# EasyEDA Pro project ProPrj_EDA-RobotPro AI智能机器狗_2025-11-01.epro

# Schematic EDA-RobotPro
Board Name: V0.1; Create Date: 2025-10-06; Page Name: P1; Project Name: EDA-RobotPro_机器狗Pro; Schematic Name: EDA-RobotPro; Update Date: 2025-11-01; Company: 嘉立创EDA; Page Size: A4; Version: V1.0
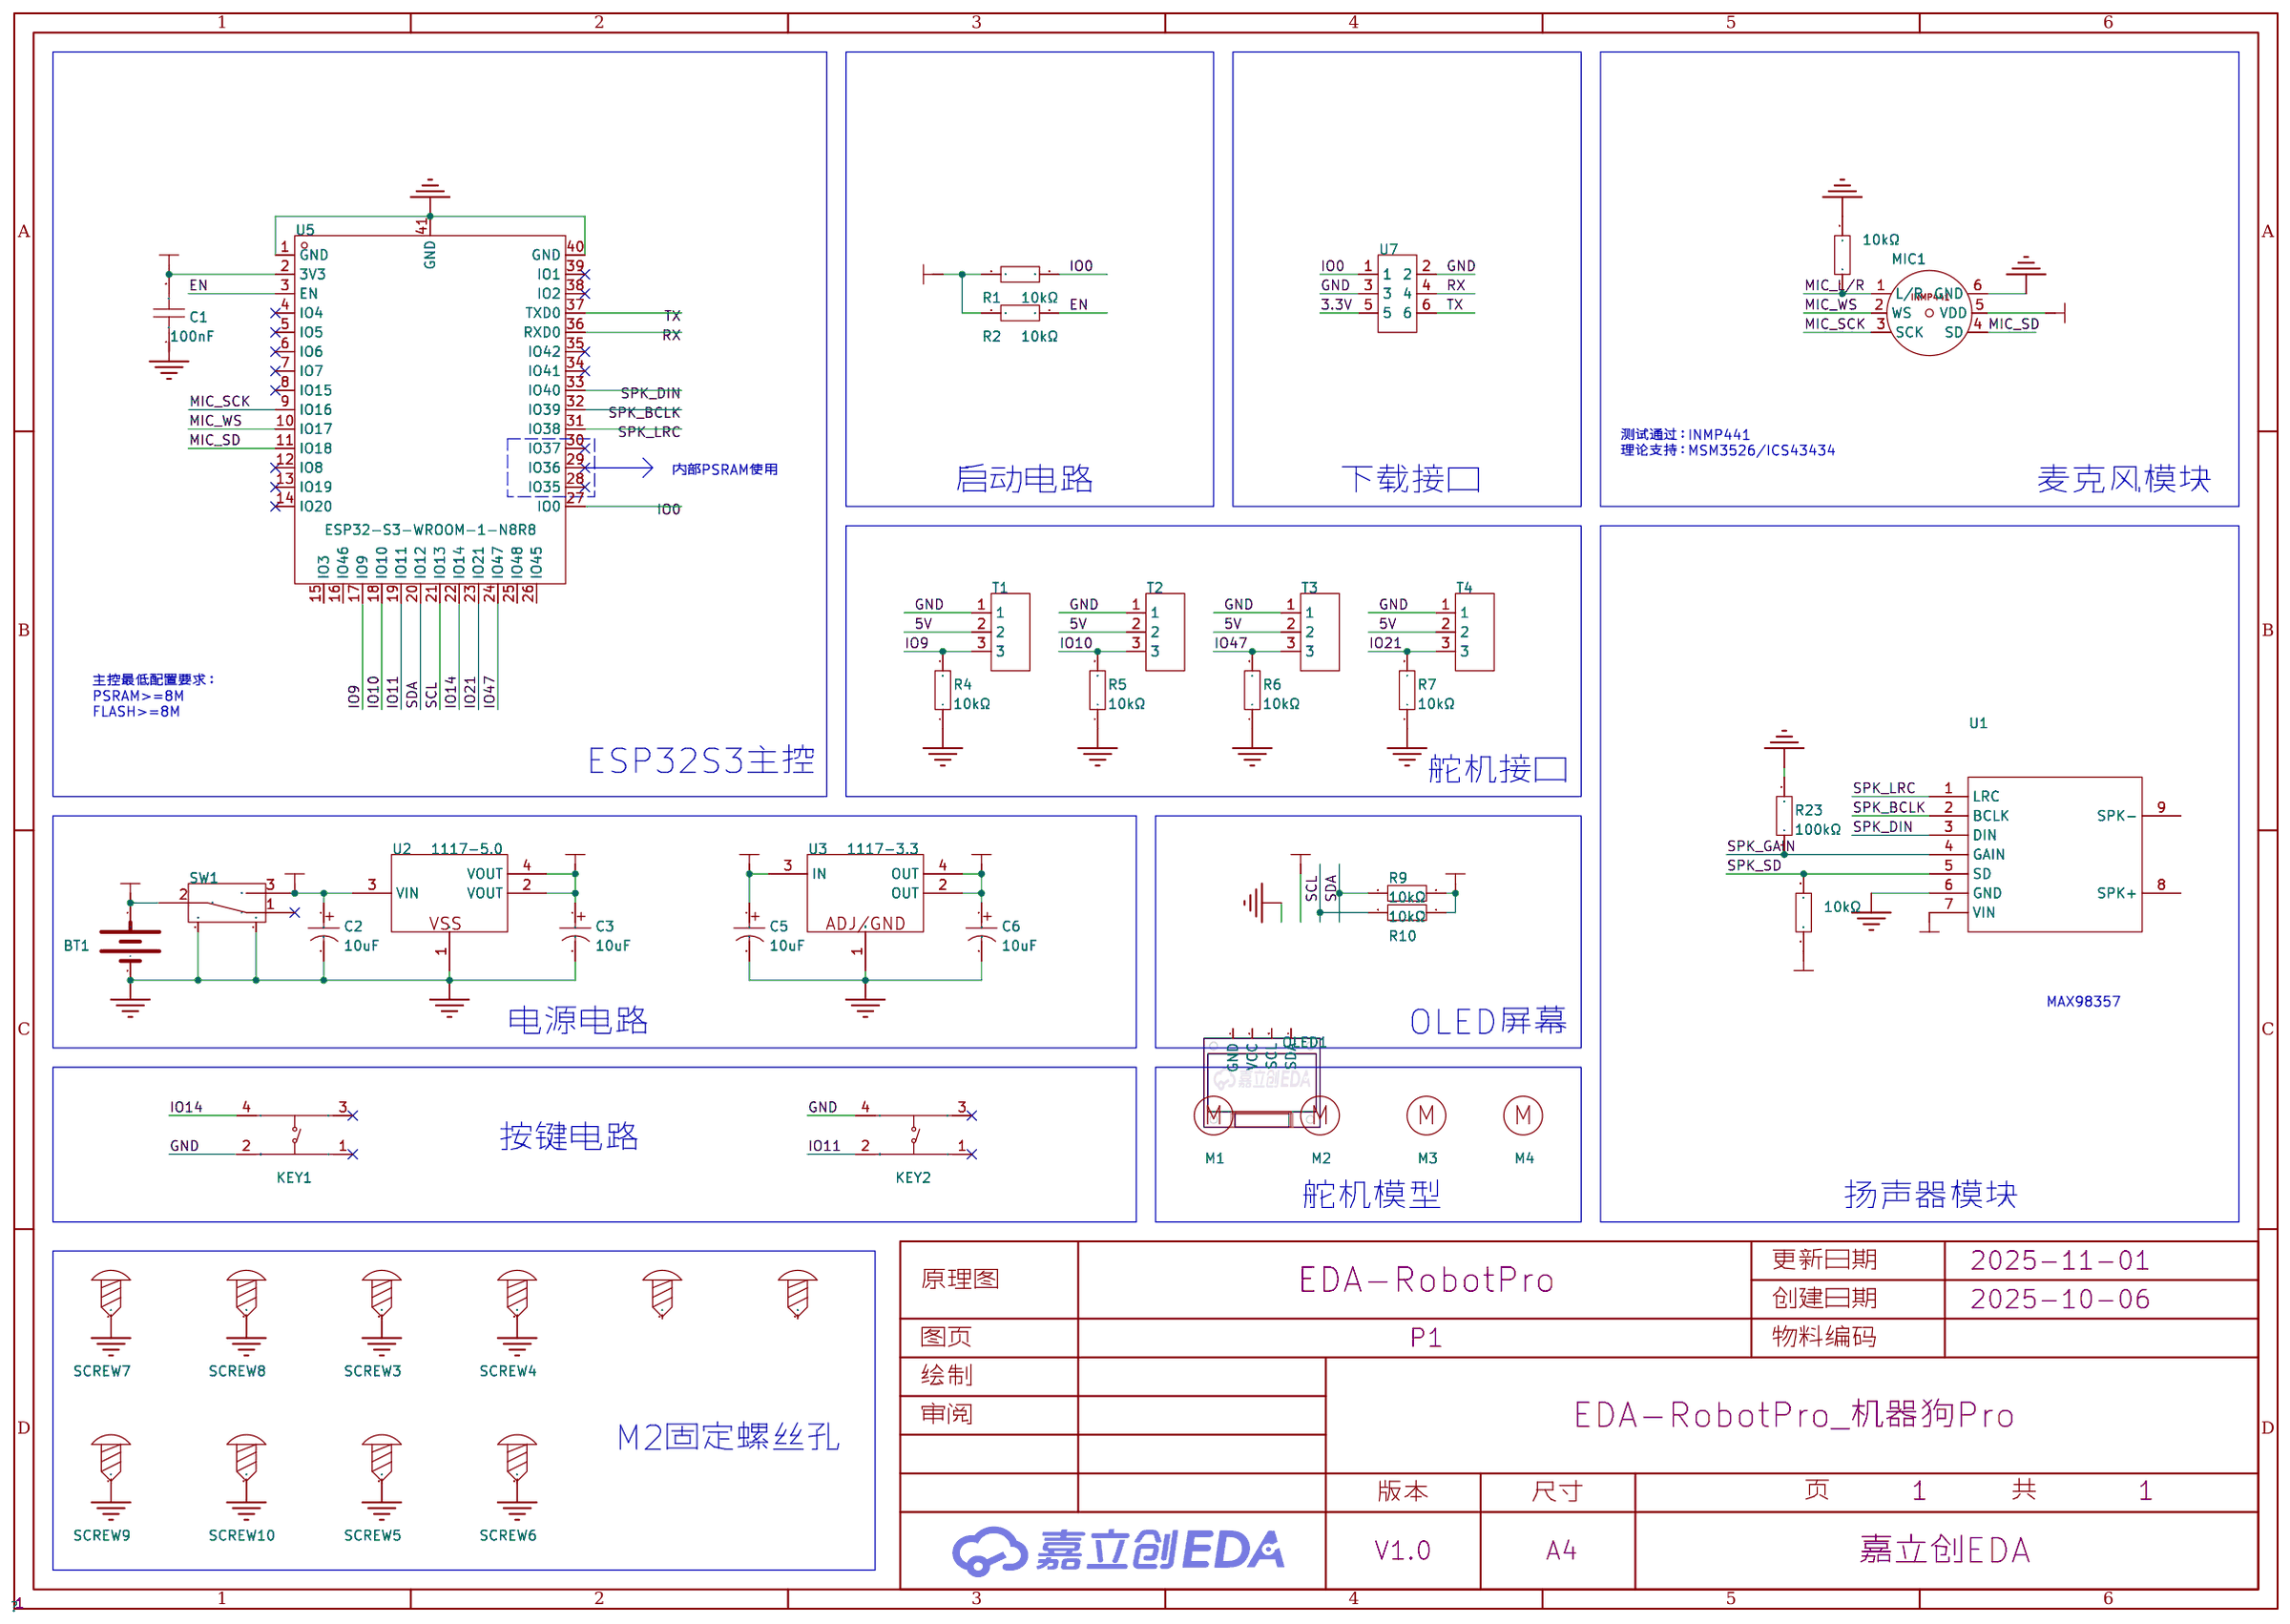
[diagram p0: schematic sheet]

## Parts
BT1  -  [2节串联14500电池盒]
C1  100nF  [CAP-TH_L4.2-W3.5-P2.54-D0.5]
C2  10uF  [CAP-TH_BD4.0-P1.50-D0.8-FD]
C3  10uF  [CAP-TH_BD4.0-P1.50-D0.8-FD]
C5  10uF  [CAP-TH_BD4.0-P1.50-D0.8-FD]
C6  10uF  [CAP-TH_BD4.0-P1.50-D0.8-FD]
KEY1  TS665CJ  [SW-TH_4P-L6.0-W6.0-P4.50-LS6.5]
KEY2  TS665CJ  [SW-TH_4P-L6.0-W6.0-P4.50-LS6.5]
M1  -  [舵机]  (no BOM)
M2  -  [舵机]  (no BOM)
M3  -  [舵机]  (no BOM)
M4  -  [舵机]  (no BOM)
MIC1  -  [COMM-TH_INMP441]
OLED1  -  [0.96OLED_4P]
R1  10kΩ  [RES-TH_BD2.4-L6.3-P10.30-D0.6]
R2  10kΩ  [RES-TH_BD2.4-L6.3-P10.30-D0.6]
R4  10kΩ  [RES-TH_BD2.4-L6.3-P10.30-D0.6]
R5  10kΩ  [RES-TH_BD2.4-L6.3-P10.30-D0.6]
R6  10kΩ  [RES-TH_BD2.4-L6.3-P10.30-D0.6]
R7  10kΩ  [RES-TH_BD2.4-L6.3-P10.30-D0.6]
R9  10kΩ  [RES-TH_BD2.4-L6.3-P10.30-D0.6]
R10  10kΩ  [RES-TH_BD2.4-L6.3-P10.30-D0.6]
R20  10kΩ  [RES-TH_BD2.4-L6.3-P10.30-D0.6]
R22  10kΩ  [RES-TH_BD2.4-L6.3-P10.30-D0.6]
R23  100kΩ  [RES-TH_BD2.4-L6.3-P10.30-D0.6]
SCREW1  -  [M2螺丝]
SCREW2  -  [M2]
SCREW3  -  [M2]
SCREW4  -  [M2]
SCREW5  -  [M2]
SCREW6  -  [M2]
SCREW7  -  [M2]
SCREW8  -  [M2]
SCREW9  -  [M2]
SCREW10  -  [M2]
SW1  -  [拨动开关_侧]
T1  PZ254V-11-03P  [HDR-TH_3P-P2.54-V-M]
T2  PZ254V-11-03P  [HDR-TH_3P-P2.54-V-M]
T3  PZ254V-11-03P  [HDR-TH_3P-P2.54-V-M]
T4  PZ254V-11-03P  [HDR-TH_3P-P2.54-V-M]
U1  -  [MAX98357]
U2  1117-5.0  [SOT-223-4_L6.5-W3.5-P2.30-LS7.0-BR]
U3  1117-3.3  [SOT-223-3_L6.4-W3.5-P2.30-LS7.0-BR]
U5  ESP32-S3-WROOM-1-N8R8  [WIRELM-SMD_ESP32-S3-WROOM-1]
U7  ZX-PZ2.54-2-3PZZ  [HDR-TH_6P-P2.54-V-M-R2-C3-S2.54-1]

## Library data of the parts
BT1 = 2节串联14500电池组: 连接器类型:电池底座;适用电池规格:CR1220;触头材质:磷青铜;工作温度范围:-25℃~+85℃;; JLCPCB Part Class: 扩展库
C1 = 178MU0006: 容值:100nF;精度:±10%;额定电压:50V;温度系数:X7R;; LCSC Part Name: 100nF ±10% 50V; Supplier Part: C5632430; Manufacturer: KNSCHA(科尼盛); Supplier Footprint: 插件,P=2.54mm; JLCPCB Part Class: 扩展库; Datasheet: https://atta.szlcsc.com/upload/public/pdf/source/20230506/6B3136079A6D587E863927628E877AC6.pdf; Supplier: LCSC; Tolerance: ±10%; Voltage Rated: 50V; Temperature Coefficient: X7R
C2 C3 C5 C6 = KS106M025C07RR0VH2FP0: 容值:10uF;精度:±20%;额定电压:25V;纹波电流:29mA@120Hz;等效串联电阻:-;; LCSC Part Name: 10uF ±20% 25V; Supplier Part: C43351; Manufacturer: CX(承兴); Supplier Footprint: 插件,D4xL7mm; JLCPCB Part Class: 扩展库; Datasheet: https://atta.szlcsc.com/upload/public/pdf/source/20211027/7B10195EF01EB9374BE8935690E3D906.pdf; Supplier: LCSC; Tolerance: ±20%; Rated Voltage: 25V; Ripple Current: 29mA@120Hz; Lead Spacing: 1.5mm; φD: 4mm; L: 7mm; Lifetime @ Temp: 1000hrs@105℃; Operating Temperature: -40℃~+105℃
KEY1 KEY2 = TS665CJ: 电路结构:单刀单掷;按钮形状:圆形按钮;安装方式:直插;开关长度:6mm;开关宽度:6mm;开关高度:5mm;触点电流:50mA;额定电压(DC):12V;带灯:-;机械寿命:-;; LCSC Part Name: 6*6*5mm 直插 轻触开关; Supplier Part: C393938; Manufacturer: SHOU HAN(首韩); Supplier Footprint: 插件; JLCPCB Part Class: 扩展库; Datasheet: https://atta.szlcsc.com/upload/public/pdf/source/20190521/C393938_BDABEAC600B4C55E200A80AA129B70BC.pdf; Supplier: LCSC; Circuit: 单刀单掷; Actuator Style: 圆形按钮; Mounting Style: 直插; Switch Length: 6mm; Switch Width: 6mm; Switch Height: 5mm; Contact Current: 50mA; Voltage Rating (DC): 12V
M1-M4 = SG90舵机(180度版): JLCPCB Part Class: 扩展库
MIC1 = inmp441: inmp441麦克风
OLED1 = 0.96OLED模块_4P: Supplier Footprint: 插件
R1 R2 R4-R7 R9 R10 R20 R22 = RN1/4W10KFT/BA1: 电阻类型:金属膜电阻;阻值:10kΩ;精度:±1%;功率:250mW;温度系数:±50ppm/℃;; LCSC Part Name: 10kΩ ±1% 250mW 金属膜电阻; Supplier Part: C410695; Manufacturer: Tyohm(幸亚电阻); Supplier Footprint: 插件,D2.4xL6.5mm; JLCPCB Part Class: Extended Part; Datasheet: https://atta.szlcsc.com/upload/public/pdf/source/20190808/C410699_D126E64D28B638F1D73B58E9F61DFD9B.pdf; Supplier: LCSC; Type: 金属膜电阻; Tolerance: ±1%; Overload Voltage (Max): 250V; Power(Watts): 250mW; Temperature Coefficient: ±50ppm/℃; Operating Temperature Range: -55℃~+125℃
R23 = MFR-25JT-52-100K: 电阻类型:金属膜电阻;阻值:100kΩ;精度:±5%;功率:250mW;; LCSC Part Name: 金属膜电阻 100kΩ ±5% 250mW; Supplier Part: C176449; Manufacturer: YAGEO(国巨); Supplier Footprint: 插件,D2.4xL6.3mm; JLCPCB Part Class: Extended Part; Datasheet: https://atta.szlcsc.com/upload/public/pdf/source/20191118/C457825_18355E864DE4965678DC27B0EBC3E21E.pdf; Supplier: LCSC; Type: 金属膜电阻; Tolerance: ±5%; Power(Watts): 250mW; Operating Temperature: -55℃~+155℃
SCREW1-SCREW10 = M2螺丝: Supplier Footprint: 插件
SW1 = 拨动开关_侧: Supplier Footprint: 插件
T1-T4 = PZ254V-11-03P: 插针结构:1x3P;间距:2.54mm;行距:-;圆针/方针:方针;安装类型:直插;排数:单排;总PIN位数:3P;额定电流:3A;额定电压:250V;配合针长度:6mm;塑高:2.5mm;端接针长度:3mm;工作温度范围:-40℃~+105℃;颜色:黑色;; LCSC Part Name: 间距:2.54mm 1x3P 直插 方针; Supplier Part: C2937625; Manufacturer: XFCN(兴飞); Supplier Footprint: 插件,P=2.54mm; JLCPCB Part Class: 扩展库; Datasheet: https://atta.szlcsc.com/upload/public/pdf/source/20200309/C492402_8335C3D49C4E4C618838D59BB1D024C1.pdf; Supplier: LCSC; Pin Structure: 1x3P; Pitch: 2.54mm; Circluar Pins/Square Pins: 方针; Mounting Type: 直插; Number of Rows: 单排; Number of Pins: 3P; Current Rating (Max): 3A; Voltage Rating (Max): 250V; Length of Mating Pin: 6mm; Insulation Height: 2.5mm; Length of End Connection Pin: 3mm; Operating Temperature Range: -40℃~+105℃; Color: 黑色
U1 = MAX98357
U2 = AMS1117-5.0V-JSM: 输出类型:固定;最大输入电压:7V;输出电压:5V;输出电流:1.2A;输出极性:正极;; Supplier Part: C33960103; Manufacturer: JSMSEMI(杰盛微); Supplier Footprint: SOT-223; JLCPCB Part Class: 扩展库; Datasheet: https://atta.szlcsc.com/upload/public/pdf/source/20240726/72CF67FA2D7FB08ABD3FCBAE5A5E891D.pdf; Supplier: LCSC; Output Type: 固定; Maximum Input Voltage: 7V; Output Voltage: 5V; Output Current: 1.2A; Output Polarity: 正极; Number of Outputs: 1
U3 = AMS1117-3.3RG: 输出类型:固定;工作电压:15V;输出电压:3.3V;输出电流:1A;电源纹波抑制比(PSRR):75dB@(120Hz);输出极性:正极;; Supplier Part: C2977152; Manufacturer: HGC(深圳汉芯); Supplier Footprint: SOT-223; JLCPCB Part Class: 扩展库; Datasheet: https://atta.szlcsc.com/upload/public/pdf/source/20230106/F6C9C2A98A494CF2EA4EB17C923E5B82.pdf; Supplier: LCSC; Output Type: 固定; Voltage - Supply: 15V; Output Voltage: 3.3V; Output Current: 1A; Power Supply Rejection Ratio (PSRR): 75dB@(120Hz); Features: 防静电保护；热关断(TSD)；过流保护(OCP); Operating Temperature: -40℃~+125℃@(Tj); Output Configuration: 正极; Number of Outputs: 1
U5 = ESP32-S3-WROOM-1-N8R8: Supplier Part: C2913201; Manufacturer: ESPRESSIF(乐鑫); Supplier Footprint: SMD,25.5x18mm; JLCPCB Part Class: 扩展库; Datasheet: https://item.szlcsc.com/datasheet/ESP32-S3-WROOM-1-N8R8/3198299.html; Supplier: LCSC
U7 = ZX-PZ2.54-2-3PZZ: 插针结构:2x3P;间距:2.54mm;行距:2.54mm;圆针/方针:方针;安装方式:直插;排数:双排;总PIN位数:6P;额定电流:3A;额定电压:1kV;配合针长度:6mm;塑高:2.5mm;端接针长度:3mm;触头材质:黄铜;触头镀层:金;工作温度:-40℃~+105℃;颜色:黑色;; LCSC Part Name: 2x3P 间距:2.54mm 方针 直插; Supplier Part: C7501274; Manufacturer: Megastar(兆星); Supplier Footprint: 插件,P=2.54mm; JLCPCB Part Class: 扩展库; Datasheet: https://item.szlcsc.com/datasheet/ZX-PZ2.54-2-3PZZ/8582487.html; Supplier: LCSC; Pin Structure: 2x3P; Pitch: 2.54mm; Row Spacing: 2.54mm; Circluar Pins/Square Pins: 方针; Mounting Type: 直插; Number of Rows: 双排; Number of Pins: 6P; Current Rating: 3A; Voltage Rating (Max): 1kV; Length of Mating Pin: 6mm; Insulation Height: 2.5mm; Length of End Connection Pin: 3mm; Contact Material: 黄铜; Contact Plating: 金; Operating Temperature: -40℃~+105℃; Color: 黑色

## Nets
3.3V: C1.2 C6.1 MIC1.5(VDD) R1.1 R2.1 R9.1 R10.1 R20.1 U1.7(VIN) U3.2(OUT) U3.4(OUT) U5.2(3V3) U7.5
5V: C3.1 T1.2 T2.2 T3.2 T4.2 U2.2(VOUT) U2.4(VOUT)
GND: BT1.2(-) C1.1 C2.2 C3.2 C5.2 C6.2 KEY1.2(B) KEY2.4(D) MIC1.6(GND) R4.1 R5.1 R6.1 R7.1 R22.2 R23.2 SCREW3.1 SCREW4.1 SCREW5.1 SCREW6.1 SCREW7.1 SCREW8.1 SCREW9.1 SCREW10.1 SW1.4 SW1.5 T1.1 T2.1 T3.1 T4.1 U1.6(GND) U2.1(VSS) U3.1(ADJ/GND) U5.1(GND) U5.40(GND) U5.41(GND) U7.2 U7.3
VBAT: C2.1 C5.1 SW1.3 U2.3(VIN) U3.3(IN)
VIN: BT1.1(+) SW1.2
EN: R2.2 U5.3(EN)
IO0: R1.2 U5.27(IO0) U7.1
IO9: R4.2 T1.3 U5.17(IO9)
IO10: R5.2 T2.3 U5.18(IO10)
IO11: KEY2.2(B) U5.19(IO11)
IO14: KEY1.4(D) U5.22(IO14)
IO21: R7.2 T4.3 U5.23(IO21)
IO47: R6.2 T3.3 U5.24(IO47)
MIC_L/R: MIC1.1(L/R) R22.1
MIC_SCK: MIC1.3(SCK) U5.9(IO16)
MIC_SD: MIC1.4(SD) U5.11(IO18)
MIC_WS: MIC1.2(WS)
RX: U5.36(RXD0) U7.4
SCL: R10.2 U5.21(IO13)
SDA: R9.2 U5.20(IO12)
SPK_BCLK: U1.2(BCLK) U5.32(IO39)
SPK_DIN: U1.3(DIN) U5.33(IO40)
SPK_GAIN: R23.1 U1.4(GAIN)
SPK_LRC: U1.1(LRC) U5.31(IO38)
SPK_SD: R20.2 U1.5(SD)
TX: U5.37(TXD0) U7.6

Not connected (* = marked no-connect by the designer): KEY1 1(A)* 3(C)*; KEY2 1(A)* 3(C)*; OLED1 1(GND) 2(VCC) 3(SCL) 4(SDA); SCREW1 1; SCREW2 1; SW1 1*; U1 8(SPK+) 9(SPK-); U5 4(IO4)* 5(IO5)* 6(IO6)* 7(IO7)* 8(IO15)* 10(IO17) 12(IO8)* 13(IO19)* 14(IO20)* 15(IO3) 16(IO46) 25(IO48) 26(IO45) 28(IO35)* 29(IO36)* 30(IO37)* 34(IO41)* 35(IO42)* 38(IO2)* 39(IO1)*

## Notes on the sheet
- 测试通过：INMP441
  理论支持：MSM3526/ICS43434
- 内部PSRAM使用
- 启动电路
- 下载接口
- 麦克风模块
- 主控最低配置要求：
  PSRAM>=8M
  FLASH>=8M
- ESP32S3主控
- 舵机接口
- MAX98357
- 电源电路
- OLED屏幕
- 按键电路
- 舵机模型
- 扬声器模块
- M2固定螺丝孔

# Board PCB2_2
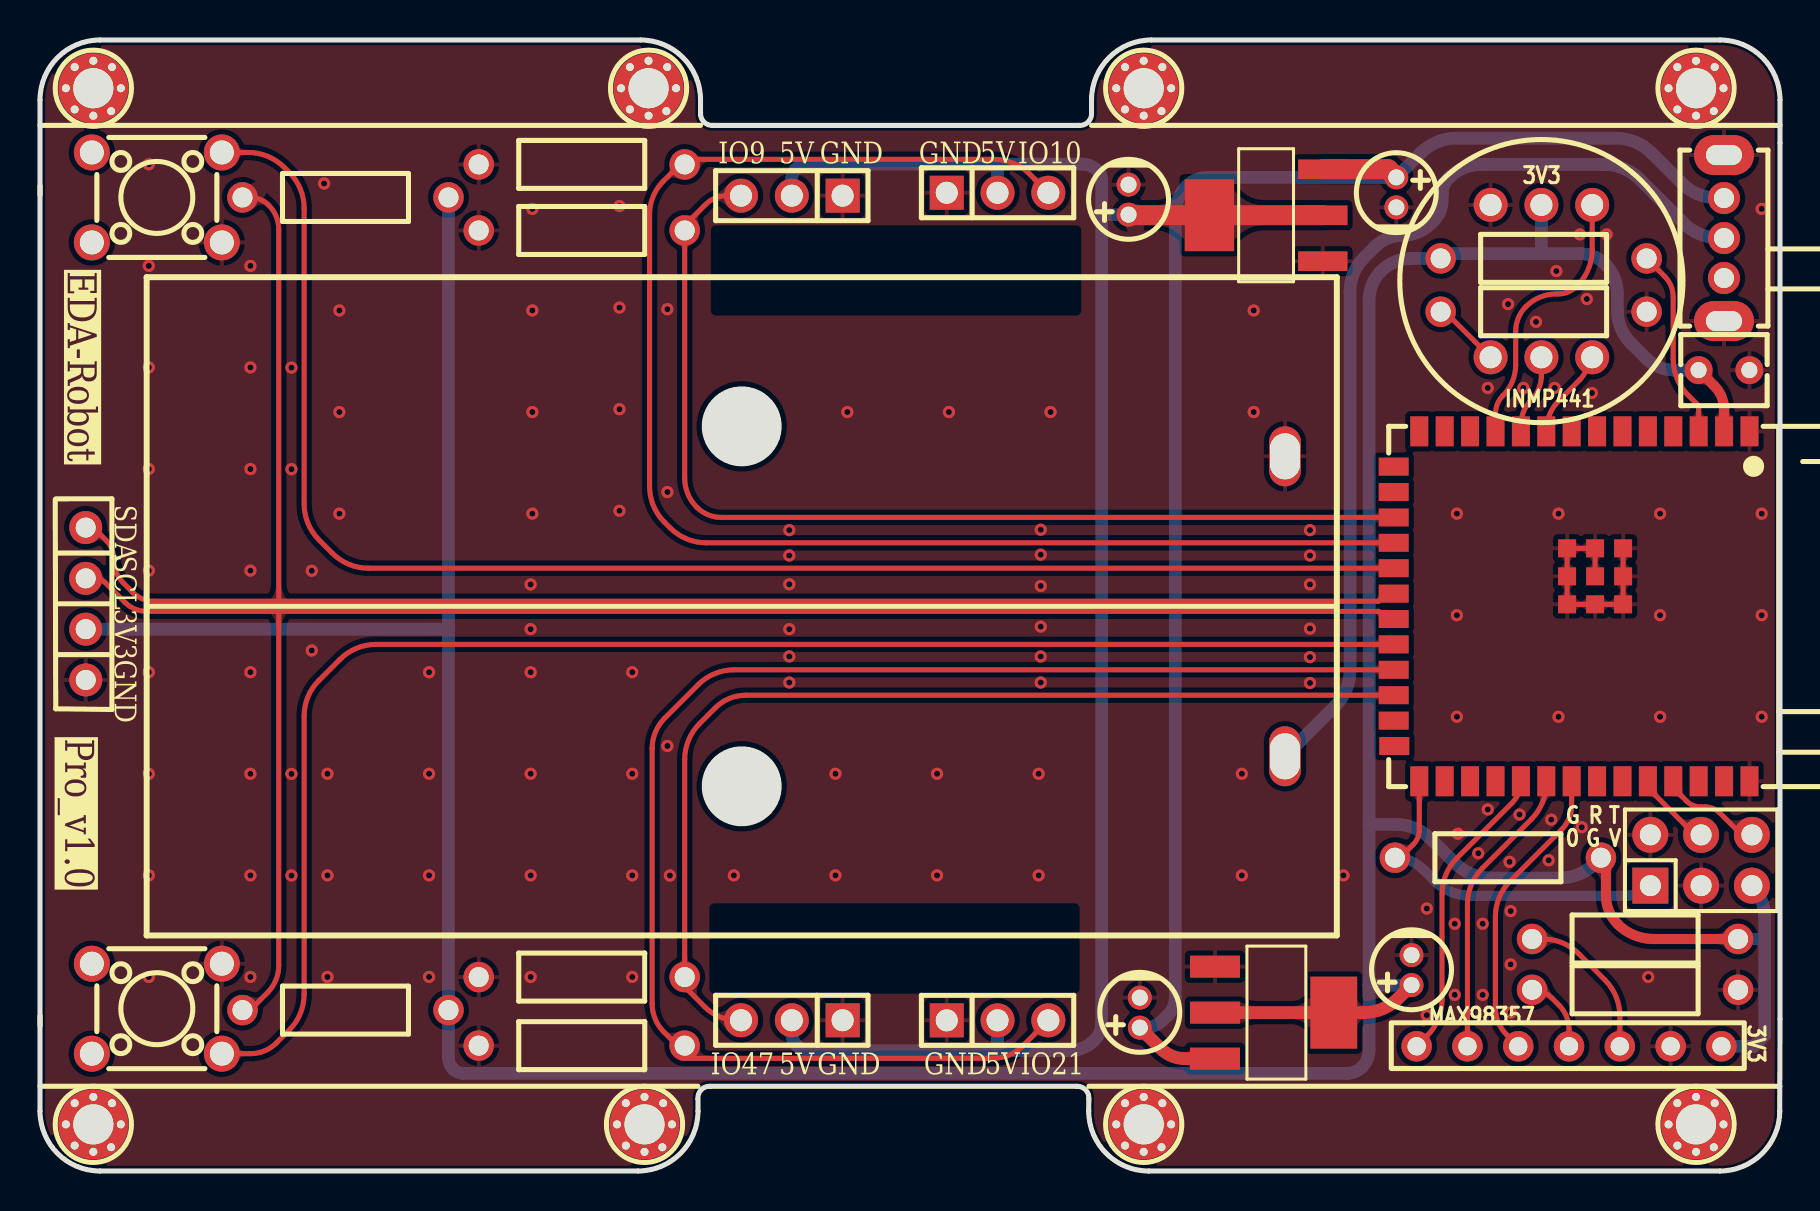
[diagram p1: board, top side]
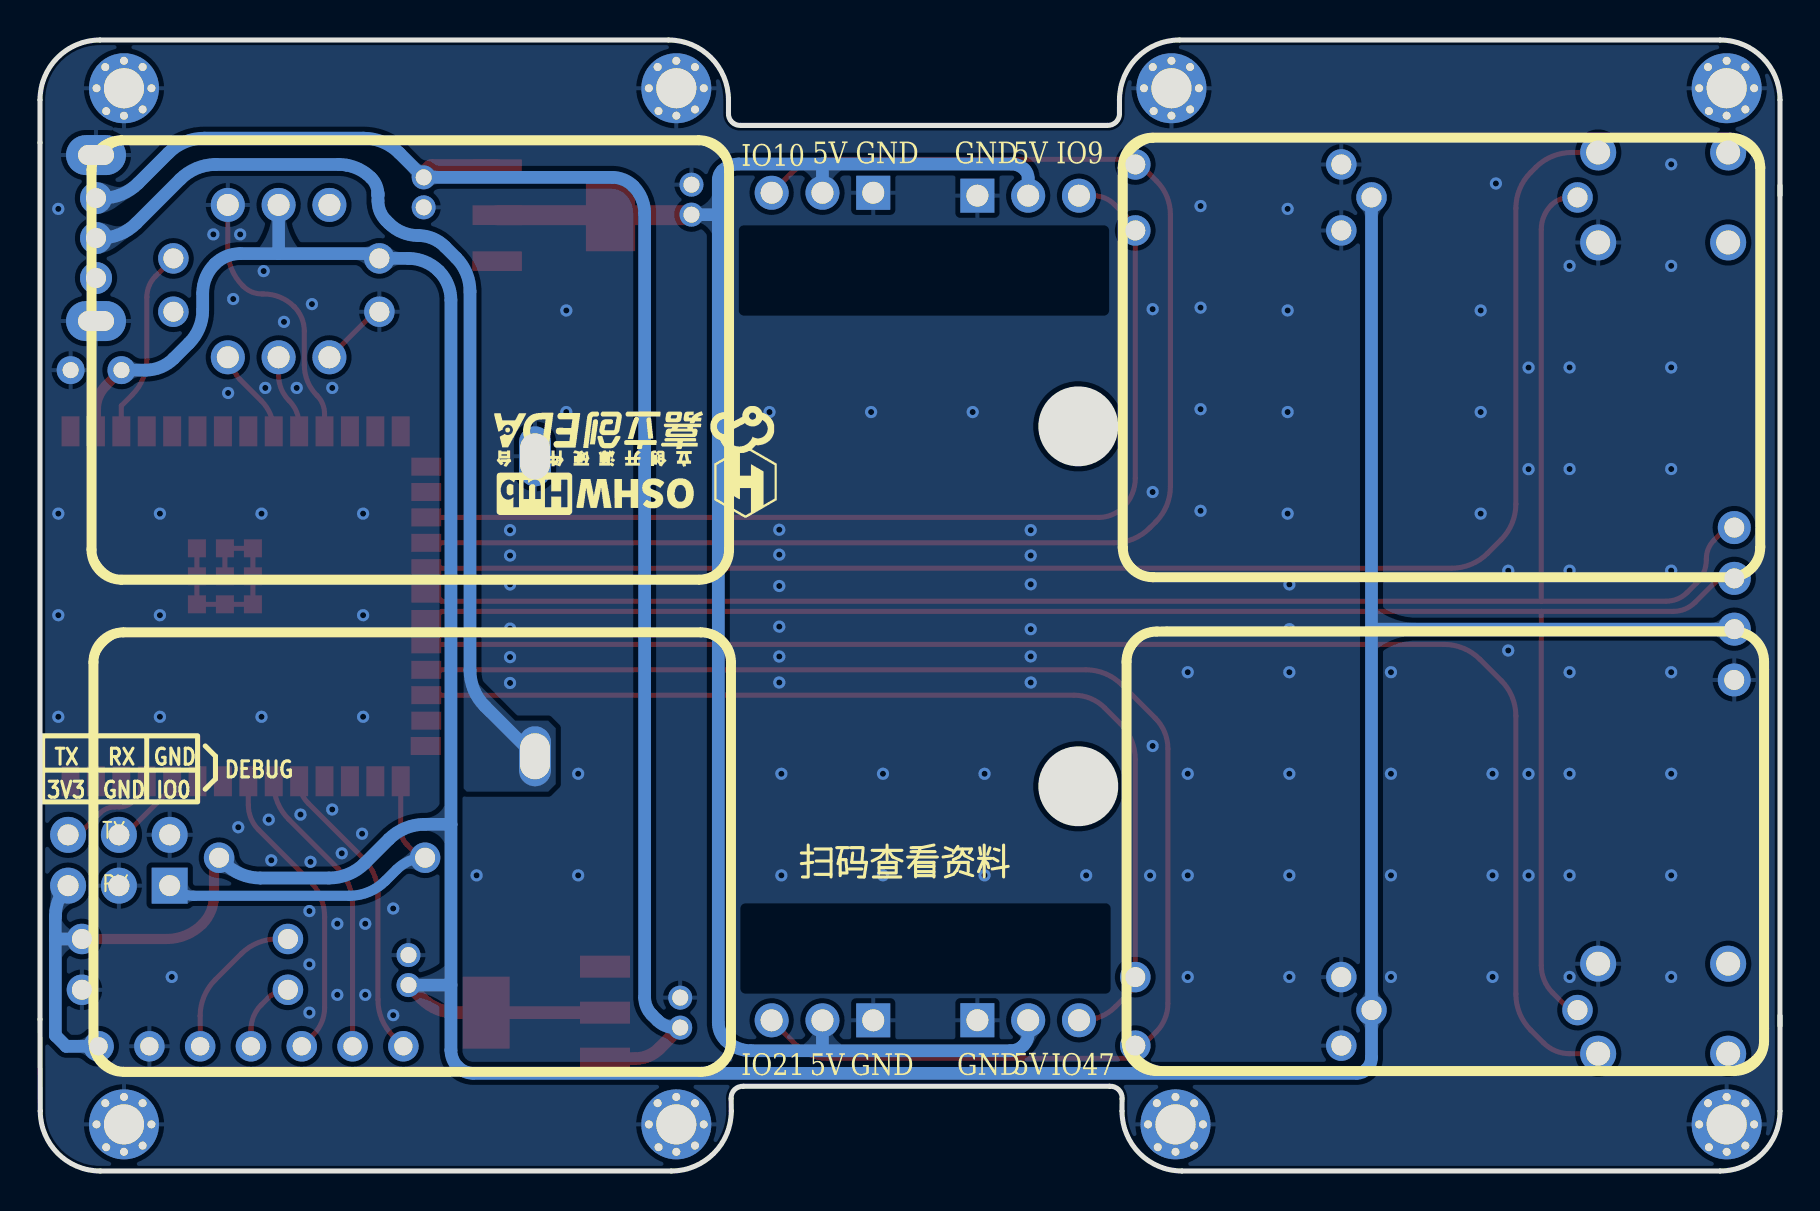
[diagram p2: board, bottom side, seen from below]

Outline 87 x 56.56 mm; copper layers: Top Layer, Bottom Layer. Coordinates in mm from the lower left corner of the outline.
Outline path: 0,48.8 0,53.56 arc(0.88,55.68) 3,56.56 30.03,56.56 arc(32.15,55.68) 33.03,53.56 33.03,52.92 arc(33.19,52.46) 33.65,52.29 51.95,52.29 arc(52.41,52.46) 52.58,52.91 52.58,53.56 arc(53.46,55.68) 55.58,56.56 84,56.56 arc(86.12,55.68) 87,53.56 87,7.59 86.99,3 arc(86.11,0.88) 83.99,0 55.44,0 arc(53.32,0.88) 52.44,3 52.45,3.61 arc(52.28,4.07) 51.83,4.24 33.52,4.24 arc(33.07,4.07) 32.9,3.62 32.9,3 arc(32.02,0.88) 29.9,0 3,0 arc(0.88,0.88) 0,3 0,7.76 ; 0,7.27 0,49.27
Stack: Top Layer 0.035mm / Dielectric1 1.51mm FR4 er 4.5 / Bottom Layer 0.035mm

## Design rules (mm)
template: 自定义配置
spacing copperThickness1oz (default): track to track 0.102, other pairs 0.152 to 0.3
spacing copperThickness2oz: track to track 0.203, other pairs 0.152 to 0.3
track width copperThickness1oz (default): min 0.127, default 0.254, max 2.54
track width copperThickness2oz: min 0.203, default 0.254, max 2.54
differential pair differentialPair (default): width min 0.127, default 0.254, max 2.54; gap min 0.152, default 0.152
via viaSize (default): diameter min 0.5, default 0.61, max 10; hole min 0.3, default 0.305, max 6.3

## Placement (name value [footprint] x y rotation side)
BT1  -  [2节串联14500电池盒]  35.09 28.24 180 top
C1  100nF  [CAP-TH_L4.2-W3.5-P2.54-D0.5]  84.2 40.05 180 top
C2  10uF  [CAP-TH_BD4.0-P1.50-D0.8-FD]  67.82 48.94 270 top
C3  10uF  [CAP-TH_BD4.0-P1.50-D0.8-FD]  54.43 48.58 90 top
C5  10uF  [CAP-TH_BD4.0-P1.50-D0.8-FD]  54.99 7.92 90 top
C6  10uF  [CAP-TH_BD4.0-P1.50-D0.8-FD]  68.58 10.05 90 top
KEY1  TS665CJ  [SW-TH_4P-L6.0-W6.0-P4.50-LS6.5]  5.84 8.12 0 top
KEY2  TS665CJ  [SW-TH_4P-L6.0-W6.0-P4.50-LS6.5]  5.84 48.69 0 top
M1  -  [舵机]  0.8 51.73 0 bottom
M2  -  [舵机]  52.32 51.61 0 bottom
M3  -  [舵机]  32.8 5 180 bottom
M4  -  [舵机]  84.49 4.87 180 bottom
MIC1  -  [COMM-TH_INMP441]  75.06 44.62 0 top
OLED1  -  [0.96OLED_4P]  2.29 28.37 90 top
R1  10kΩ  [RES-TH_BD2.4-L6.3-P10.30-D0.6]  72.9 15.67 180 top
R2  10kΩ  [RES-TH_BD2.4-L6.3-P10.30-D0.6]  75.18 45.64 0 top
R4  10kΩ  [RES-TH_BD2.4-L6.3-P10.30-D0.6]  27.09 47.04 0 top
R5  10kΩ  [RES-TH_BD2.4-L6.3-P10.30-D0.6]  27.09 50.34 0 top
R6  10kΩ  [RES-TH_BD2.4-L6.3-P10.30-D0.6]  27.09 9.7 0 top
R7  10kΩ  [RES-TH_BD2.4-L6.3-P10.30-D0.6]  27.09 6.27 0 top
R9  10kΩ  [RES-TH_BD2.4-L6.3-P10.30-D0.6]  15.28 48.69 180 top
R10  10kΩ  [RES-TH_BD2.4-L6.3-P10.30-D0.6]  15.28 8.05 180 top
R20  10kΩ  [RES-TH_BD2.4-L6.3-P10.30-D0.6]  79.76 11.6 180 top
R22  10kΩ  [RES-TH_BD2.4-L6.3-P10.30-D0.6]  75.18 42.97 0 top
R23  100kΩ  [RES-TH_BD2.4-L6.3-P10.30-D0.6]  79.76 9.06 0 top
SCREW3  -  [M2]  2.67 2.33 0 top
SCREW4  -  [M2]  30.23 2.33 0 top
SCREW5  -  [M2]  55.19 2.33 0 top
SCREW6  -  [M2]  82.8 2.33 0 top
SCREW7  -  [M2]  2.67 54.15 0 top
SCREW8  -  [M2]  30.43 54.15 0 top
SCREW9  -  [M2]  55.19 54.15 0 top
SCREW10  -  [M2]  82.8 54.15 0 top
SW1  -  [拨动开关_侧]  84.2 46.66 90 top
T1  PZ254V-11-03P  [HDR-TH_3P-P2.54-V-M]  37.59 48.77 180 top
T2  PZ254V-11-03P  [HDR-TH_3P-P2.54-V-M]  47.88 48.92 0 top
T3  PZ254V-11-03P  [HDR-TH_3P-P2.54-V-M]  37.59 7.54 180 top
T4  PZ254V-11-03P  [HDR-TH_3P-P2.54-V-M]  47.88 7.54 0 top
U1  -  [MAX98357]  67.56 4.24 0 top
U2  1117-5.0  [SOT-223-4_L6.5-W3.5-P2.30-LS7.0-BR]  61.31 47.8 0 top
U3  1117-3.3  [SOT-223-3_L6.4-W3.5-P2.30-LS7.0-BR]  61.72 7.92 180 top
U5  ESP32-S3-WROOM-1-N8R8  [WIRELM-SMD_ESP32-S3-WROOM-1]  76.58 28.24 270 top
U7  ZX-PZ2.54-2-3PZZ  [HDR-TH_6P-P2.54-V-M-R2-C3-S2.54-1]  83.06 15.54 0 top

## Footprints (pads in the part's own frame, mm; a bottom-side part is the same pattern mirrored in y, then rotated)
0.96OLED_4P
  round 1.65 hole 1: 1(-3.81,-0.002) 2(-1.27,0.002) 3(1.27,0.002) 4(3.81,0.002)
2节串联14500电池盒
  oval 1.6x3 hole 1.5x2.3: 1(-27.165,7.5) 2(-27.165,-7.5)
CAP-TH_BD4.0-P1.50-D0.8-FD
  round 1.2 hole 0.8: 1(-0.75,0) 2(0.75,0)
CAP-TH_L4.2-W3.5-P2.54-D0.5
  round 1.4 hole 0.8: 1(-1.27,0) 2(1.27,0)
COMM-TH_INMP441
  round 1.7 hole 1.1: 1(-2.525,-3.93) 2(0.015,-3.93) 3(2.555,-3.93) 4(2.555,3.69) 5(0.015,3.69) 6(-2.525,3.69)
HDR-TH_3P-P2.54-V-M
  rect 1.7x1.7 hole 1.1: 1(-2.54,0)
  round 1.7 hole 1.1: 2(0,0) 3(2.54,0)
HDR-TH_6P-P2.54-V-M-R2-C3-S2.54-1
  rect 1.8x1.8 hole 1.05: 1(-2.54,-1.27)
  round 1.8 hole 1.05: 2(-2.54,1.27) 3(0,-1.27) 4(0,1.27) 5(2.54,-1.27) 6(2.54,1.27)
M2
  round 0.6 hole 0.4: 1(-1.373,0) 1(-0.933,1.06) 1(-0.933,-1.06) 1(0,1.373) 1(0,-1.373) 1(0.889,-1.143) 1(0.933,1.06) 1(1.373,0)
  round 3.5 hole 2.005: 1(0,0)
MAX98357
  round 1.524 hole 0.914: 1(1.27,2) 2(3.81,2) 3(6.35,2) 4(8.89,2) 5(11.43,2) 6(13.97,2) 7(16.51,2)
RES-TH_BD2.4-L6.3-P10.30-D0.6
  round 1.524 hole 1: 1(-5.15,0) 2(5.15,0)
SOT-223-3_L6.4-W3.5-P2.30-LS7.0-BR
  rect 2.5x1.1 smd: 1(2.97,-2.3) 2(2.97,0) 3(2.97,2.3)
  rect 2.34x3.6 smd: 4(-2.97,0)
SOT-223-4_L6.5-W3.5-P2.30-LS7.0-BR
  rect 2.47x0.98 smd: 1(2.835,-2.3) 2(2.835,0) 3(2.835,2.3)
  rect 2.47x3.6 smd: 4(-2.835,0)
SW-TH_4P-L6.0-W6.0-P4.50-LS6.5
  round 1.8 hole 1.2: 1(-3.25,2.25) 2(3.25,2.25) 3(-3.25,-2.25) 4(3.25,-2.25)
WIRELM-SMD_ESP32-S3-WROOM-1
  rect 1.5x0.9 smd: 1(-8.75,8.895) 2(-8.75,7.625) 3(-8.75,6.355) 4(-8.75,5.085) 5(-8.75,3.815) 6(-8.75,2.545) 7(-8.75,1.275) 8(-8.75,0.005) 9(-8.75,-1.265) 10(-8.75,-2.535) 11(-8.75,-3.805) 12(-8.75,-5.075) 13(-8.75,-6.345) 14(-8.75,-7.615) 27(8.75,-7.615) 28(8.75,-6.345) 29(8.75,-5.075) 30(8.75,-3.805) 31(8.75,-2.535) 32(8.75,-1.265) 33(8.75,0.005) 34(8.75,1.275) 35(8.75,2.545) 36(8.75,3.815) 37(8.75,5.085) 38(8.75,6.355) 39(8.75,7.625) 40(8.75,8.895)
  rect 0.9x1.5 smd: 15(-6.985,-8.895) 16(-5.715,-8.895) 17(-4.445,-8.895) 18(-3.175,-8.895) 19(-1.905,-8.895) 20(-0.635,-8.895) 21(0.635,-8.895) 22(1.905,-8.895) 23(3.175,-8.895) 24(4.445,-8.895) 25(5.715,-8.895) 26(6.985,-8.865)
  rect 0.9x0.9 smd: 41(-2.9,2.575) 41(-2.9,1.175) 41(-2.9,-0.225) 41(-1.5,2.575) 41(-1.5,1.175) 41(-1.5,-0.225) 41(-0.1,2.575) 41(-0.1,1.175) 41(-0.1,-0.225)
拨动开关_侧
  oval 1.6x1.6 hole 1.001: 1(-1.999,0) 2(0,0) 3(1.999,0)
  oval 1.999x2.999 hole 1.001x1.801: 4(4.151,0) 5(-4.151,0)

## Nets
As in the schematic, except:
3.3V: C1.2 C6.1 MIC1.5 OLED1.2 R1.1 R2.1 R9.1 R10.1 R20.1 U1.7 U3.2 U3.4 U5.2 U7.5
GND: BT1.2 C1.1 C2.2 C3.2 C5.2 C6.2 KEY1.2 KEY2.4 MIC1.6 OLED1.1 R4.1 R5.1 R6.1 R7.1 R22.2 R23.2 SCREW3.1 SCREW4.1 SCREW5.1 SCREW6.1 SCREW7.1 SCREW8.1 SCREW9.1 SCREW10.1 SW1.4 SW1.5 T1.1 T2.1 T3.1 T4.1 U1.6 U2.1 U3.1 U5.1 U5.40 U5.41 U7.2 U7.3
MIC_WS: MIC1.2 U5.10
SCL: OLED1.3 R10.2 U5.21
SDA: OLED1.4 R9.2 U5.20

Pads without a net: KEY1 1 3; KEY2 1 3; SW1 1; U5 4 5 6 7 8 12 13 14 15 16 25 26 28 29 30 34 35 38 39

## Via types
v1: diameter 0.61, hole 0.305, Top Layer to Bottom Layer, 129 vias

## Routing (per net, layer and track width the routed paths; a pad name or vN(x,y) marks a point on that pad's centre or on a via; arc(x,y) is an arc through that point)
3.3V: length 219.3
  Top Layer w0.508: C1.2 83.72,39.27 arc(84.08,38.72) 84.21,38.08 U5.2 ; 78.3,15.67 78.3,13.77 arc(78.46,12.99) 78.89,12.34 arc(79.71,11.79) 80.67,11.6 84.91,11.6
  Top Layer w0.635: U3.2 U3.4 66.19,7.92 arc(67.12,8.11) 67.91,8.63 C6.1
  Bottom Layer w0.635: R1.1 77.78,15.39 arc(76.95,14.84) 75.98,14.65 72.55,14.65 arc(71.58,14.84) 70.76,15.39 69.56,16.59 arc(68.73,17.14) 67.76,17.34 66.45,17.34 ; 66.45,17.34 66.45,43.55 arc(66.61,44.34) 67.06,45 arc(67.76,45.47) 68.59,45.64 R2.1 ; 66.45,17.34 66.45,9.3 ; 86.23,11.6 84.91,11.6 ; 86.23,11.6 86.23,6.78 85.69,6.24 U1.7 ; 86.23,11.6 86.23,12.74 arc(86.07,13.57) U7.5 ; 75.07,45.88 77,45.88 arc(77.68,45.74) 78.27,45.35 arc(78.71,44.69) 78.87,43.9 78.87,43.05 arc(79.04,42.16) 79.55,41.4 80.32,40.63 arc(80.96,40.2) 81.72,40.05 C1.2 ; 75.07,45.88 75.07,48.31 ; 75.07,45.88 70.27,45.88 ; 70.2,45.48 70.23,45.51 ; C6.1 66.45,9.3 ; 66.45,9.3 66.45,6.04 arc(66.36,5.59) 66.11,5.21 arc(65.75,4.97) 65.33,4.88 21.16,4.88 arc(20.9,4.94) 20.67,5.09 arc(20.49,5.36) 20.43,5.68 R10.1 20.43,27.13 ; 78.3,15.67 78.17,15.79 ; 2.29,27.1 20.4,27.1 20.43,27.13 ; 20.43,27.13 R9.1
5V: length 90.8
  Top Layer w1: C3.1 54.46,47.8 U2.4 U2.2
  Bottom Layer w0.635: T4.2 47.88,6.11 47.79,6.01 ; 47.88,50.36 52.07,50.36 arc(52.52,50.27) 52.9,50.02 arc(53.04,49.81) 53.09,49.57 53.09,47.83 ; 47.88,50.36 T2.2 ; 47.88,50.36 38.44,50.36 arc(38.08,50.29) 37.77,50.08 arc(37.64,49.89) 37.59,49.66 T1.2 ; 47.79,6.01 51.46,6.01 arc(52.14,6.15) 52.72,6.54 arc(52.99,6.94) 53.09,7.42 53.09,47.83 ; 47.79,6.01 38.48,6.01 arc(38.13,6.08) 37.83,6.28 arc(37.65,6.55) 37.59,6.86 T3.2 ; 53.09,47.83 C3.1
GND: length 11.2
  Top Layer w0.254: U5.41 U5.41 U5.41 U5.41 U5.41 U5.41 U5.41 U5.41 U5.41
  vias: v1(5.44,50.34) v1(5.44,45.27) v1(5.44,40.18) v1(5.44,35.1) v1(5.44,30.02) v1(5.44,24.94) v1(5.44,19.86) v1(5.44,14.78) v1(5.44,9.7) v1(10.52,45.27) v1(10.52,40.18) v1(10.52,35.1) v1(10.52,30.02) v1(10.52,24.94) v1(10.52,19.86) v1(10.52,14.78) v1(10.52,9.7) v1(12.57,40.18) v1(12.57,35.1) v1(12.57,19.86) v1(12.57,14.78) v1(13.59,30.02) v1(13.59,26.03) v1(14.2,49.38) v1(14.37,19.86) v1(14.37,14.78) v1(14.37,9.7) v1(14.97,43.03) v1(14.97,37.95) v1(14.97,32.88) v1(19.45,24.94) v1(19.45,19.86) v1(19.45,14.78) v1(19.45,9.7) v1(24.62,48.11) v1(24.62,43.03) v1(24.62,37.95) v1(24.62,32.88) v1(24.53,29.33) v1(24.53,27.1) v1(24.53,24.94) v1(24.53,19.86) v1(24.53,14.78) v1(24.53,9.7) v1(28.97,48.26) v1(28.97,43.18) v1(28.97,38.1) v1(28.97,33.02) v1(29.61,24.94) v1(29.61,19.86) v1(29.61,14.78) v1(29.61,9.7) v1(31.37,43.1) v1(31.37,33.95) v1(31.37,21.25) v1(31.5,14.78) v1(34.69,14.78) v1(37.47,32.05) v1(37.47,30.78) v1(37.47,29.34) v1(37.47,27.1) v1(37.47,25.73) v1(37.47,24.43) v1(39.77,19.86) v1(39.77,14.78) v1(40.37,37.95) v1(44.85,19.86) v1(44.85,14.78) v1(45.45,37.95) v1(49.93,19.86) v1(49.93,14.78) v1(50.04,32.07) v1(50.04,30.82) v1(50.04,29.26) v1(50.04,27.22) v1(50.04,25.73) v1(50.04,24.43) v1(50.53,37.95) v1(60.09,19.86) v1(60.09,14.78) v1(60.69,43.03) v1(60.69,37.95) v1(63.5,32.05) v1(63.5,30.78) v1(63.5,29.33) v1(63.5,27.12) v1(63.5,25.7) v1(63.5,24.41) v1(65.17,14.78) v1(69.34,13.13) v1(69.34,7.79) v1(70.74,12.36) v1(70.74,8.81) v1(70.85,32.88) v1(70.85,27.8) v1(70.85,22.71) v1(70.9,16.87) v1(71.91,15.89) v1(72.14,12.36) v1(72.14,8.81) v1(72.39,39.16) v1(72.39,18.08) v1(73.41,43.35) v1(73.48,15.46) v1(73.53,13) v1(73.53,10.33) v1(73.53,7.92) v1(73.98,17.83) v1(74.17,39.16) v1(74.8,42.46) v1(75.44,15.54) v1(75.57,17.57) v1(75.82,45) v1(75.74,39.16) v1(75.93,32.88) v1(75.93,22.71) v1(77,46.84) v1(77.09,17.19) v1(77.34,43.61) v1(77.6,38.91) v1(78.33,46.84) v1(80.41,9.7) v1(81.01,32.88) v1(81.01,27.8) v1(81.01,22.71) v1(86.09,48.11) v1(86.09,32.88) v1(86.09,27.8) v1(86.09,22.71)
VBAT: length 80.2
  Top Layer w0.635: U3.3 57.25,5.62 arc(56.6,5.75) 56.04,6.12 C5.1
  Top Layer w1: C2.1 67.41,50.1 U2.3
  Bottom Layer w0.635: C5.1 55.24,7.17 arc(55.73,7.27) 56.13,7.54 56.41,7.81 arc(56.67,8.21) 56.77,8.69 56.77,47.89 arc(56.92,48.63) 57.33,49.25 arc(57.82,49.58) 58.4,49.69 C2.1 69.03,50.91 arc(69.86,51.46) 70.83,51.65 78.79,51.65 arc(79.76,51.46) 80.58,50.91 82.09,49.4 arc(82.92,48.85) 83.89,48.65 SW1.3
VIN: length 48.1
  Bottom Layer w0.635: SW1.2 83.98,46.66 arc(83.01,46.85) 82.19,47.4 79.99,49.59 arc(79.2,50.13) 78.26,50.34 arc(78.23,50.34) 78.2,50.34 72.07,50.34 arc(71.87,50.33) 71.68,50.3 arc(71.01,50.08) 70.45,49.67 arc(70.21,49.32) 70.11,48.92 ; 70.1,48.8 70.1,48.84 arc(70.1,48.88) 70.11,48.92 ; 70.1,48.8 70.1,48.52 arc(70,47.98) 69.7,47.53 69.55,47.39 arc(68.88,46.94) 68.09,46.78 arc(67.37,46.64) 66.76,46.23 66.2,45.67 arc(65.68,44.9) 65.5,43.99 65.5,25.04 arc(65.31,24.07) 64.76,23.25 BT1.1 ; 70.1,48.8 arc(70.1,48.86) 70.11,48.92
EN: length 9.6
  Top Layer w0.254: R2.2 81.23,44.74 arc(81.55,44.27) 81.66,43.71 81.66,40.59 arc(81.85,39.62) 82.41,38.8 82.94,38.27 U5.3
IO0: length 17.1
  Top Layer w0.254: 68.38,16.05 68.66,16.32 arc(68.89,16.66) 68.97,17.06 U5.27
  Bottom Layer w0.508: R1.2 arc(68.52,15.51) 69.17,15.08 69.74,14.51 arc(70.56,13.96) 71.54,13.76 79.29,13.76 arc(79.69,13.81) 80.07,13.94 arc(80.3,14.09) U7.1
IO9: length 52.6
  Top Layer w0.254: T1.3 34.34,48.77 arc(33.77,48.66) 33.28,48.34 32.24,47.29 32.24,34.65 arc(32.39,33.86) 32.84,33.19 arc(33.4,32.82) 34.07,32.68 U5.17
IO10: length 74.5
  Top Layer w0.254: T2.3 49.49,49.85 arc(48.67,50.4) 47.7,50.59 32.26,50.59 31.17,49.51 arc(30.66,48.74) 30.48,47.83 30.48,34.23 arc(30.67,33.27) 31.22,32.46 31.51,32.16 arc(32.34,31.61) 33.31,31.41 U5.18
IO11: length 76.7
  Top Layer w0.254: U5.19 16.42,30.14 arc(15.45,30.34) 14.62,30.89 13.95,31.56 arc(13.4,32.38) 13.21,33.36 13.21,48.14 arc(13.01,49.12) 12.46,49.94 12.21,50.19 arc(11.39,50.74) 10.41,50.94 KEY2.2
IO14: length 76
  Top Layer w0.254: KEY1.4 10.52,5.87 arc(11.22,6.01) 11.82,6.4 12.46,7.05 arc(13.01,7.87) 13.21,8.84 13.21,22.76 arc(13.4,23.72) 13.94,24.52 15,25.59 arc(15.83,26.14) 16.8,26.33 U5.22
IO21: length 73.8
  Top Layer w0.254: T4.3 49.13,6.25 arc(48.45,5.79) 47.65,5.63 32.51,5.63 31.2,6.95 arc(30.76,7.6) 30.61,8.37 30.61,21.12 arc(30.77,21.95) 31.24,22.65 32.91,24.32 arc(33.74,24.87) 34.71,25.06 U5.23
IO47: length 51.7
  Top Layer w0.254: 32.24,9.95 32.24,20.58 ; R6.2 32.24,9.21 33.24,8.21 arc(33.98,7.71) 34.86,7.54 T3.3 ; U5.24 35.3,23.8 arc(34.47,23.63) 33.76,23.16 32.98,22.38 arc(32.43,21.55) 32.24,20.58
MIC_L/R: length 3.4
  Top Layer w0.254: MIC1.1 70.41,42.82 arc(70.24,42.93) R22.1
MIC_SCK: length 4.7
  Top Layer w0.254: U5.9 75.32,37.01 arc(75.48,37.83) 75.95,38.53 77.01,39.59 arc(77.27,39.98) 77.36,40.44 arc(77.26,40.69) 77.36,40.94
MIC_SD: length 13.7
  Top Layer w0.254: MIC1.4 77.61,46.07 arc(77.42,45.1) 76.87,44.27 76.83,44.24 arc(76.41,43.96) 75.92,43.86 75.82,43.86 arc(75,43.7) 74.3,43.23 74.3,43.23 arc(73.92,42.66) 73.79,42 73.79,40.31 arc(73.62,39.48) 73.15,38.78 arc(72.87,38.36) 72.78,37.87 U5.11
MIC_WS: length 4
  Top Layer w0.254: U5.10 74.05,37.31 arc(74.18,37.97) 74.55,38.53 arc(74.94,39.11) 75.07,39.79 75.07,40.69
RX: length 3.9
  Top Layer w0.254: U5.36 80.4,19.17 82.53,17.03 arc(82.59,16.98) 82.64,16.94 arc(82.84,16.84) U7.4
SCL: length 87.1
  Top Layer w0.254: 11.94,27.99 66.93,27.99 67.31,27.6 U5.21 ; 11.94,27.99 11.94,10.28 arc(11.79,9.54) 11.37,8.91 10.12,7.67 ; 11.94,27.99 5.34,27.99 arc(4.75,28.1) 4.25,28.44 3.26,29.43 arc(3.03,29.58) 2.75,29.64 2.29,29.64
SDA: length 89
  Top Layer w0.254: 11.94,28.5 11.94,47.09 arc(11.81,47.74) 11.43,48.3 arc(11.01,48.59) 10.5,48.69 R9.2 ; 11.94,28.5 11.93,28.49 5.7,28.49 arc(5.13,28.61) 4.64,28.93 4.17,29.41 arc(3.81,29.94) 3.68,30.57 3.68,30.62 arc(3.58,31.12) 3.3,31.54 2.94,31.91 arc(2.64,32.11) 2.29,32.18 ; 11.94,28.5 11.94,28.49 66.93,28.49 67.31,28.88 U5.20
SPK_BCLK: length 14.7
  Top Layer w0.254: U5.32 75.32,19.39 arc(75.12,18.42) 74.57,17.59 72.12,15.14 arc(71.57,14.32) 71.37,13.34 U1.2
SPK_DIN: length 15
  Top Layer w0.254: U5.33 76.59,18.3 arc(76.45,17.63) 76.07,17.06 73.52,14.51 arc(72.96,13.68) 72.77,12.71 72.77,8.17 arc(72.92,7.44) 73.33,6.82 U1.3
SPK_GAIN: length 3.8
  Top Layer w0.254: 76.45,6.24 76.45,7.07 arc(76.32,7.74) 75.95,8.3 75.59,8.65 arc(75.14,8.96) R23.1
SPK_LRC: length 15.1
  Top Layer w0.254: U1.1 69.36,6.76 arc(69.91,7.59) 70.1,8.56 70.1,13.85 arc(70.3,14.82) 70.85,15.65 73.59,18.39 arc(73.93,18.9) U5.31
SPK_SD: length 7.9
  Top Layer w0.254: U1.5 78.99,7.76 arc(78.8,8.73) 78.25,9.55 76.94,10.86 arc(76.12,11.41) 75.15,11.6 R20.2
TX: length 5.1
  Top Layer w0.254: 85.6,16.94 84.96,16.94 84,17.9 arc(83.66,18.13) 83.26,18.21 83.04,18.21 arc(82.66,18.28) 82.33,18.5 81.67,19.17 U5.37

## Copper pours and planes (outline as drawn; the poured copper is in the pictures)
GND on Top Layer: -8.13,59.48 93.85,59.48 93.85,-1.86 -8.13,-1.86
GND on Bottom Layer: -1.91,56.69 90.93,56.69 90.93,-2.24 -1.91,-2.24
VIN on Bottom Layer: 61.21,25.06 65.82,25.06 65.82,18.97 61.21,18.97

Small or netless copper shapes (teardrops, artwork), in the pictures only: 72 on Top Layer, 33 on Bottom Layer

## Text on the board
Bottom Silkscreen Layer: TX | RX | DEBUG | IO0 | GND | 3V3 | IO9 | IO47 | 5V | IO10 | IO21 | 扫码查看资料
Top Silkscreen Layer: MAX98357 | INMP441 | G | 0 | R | T | V | 3V3 | IO47 | IO9 | 5V | GND | IO10 | IO21 | SDA | SCL | Pro_v1.0 | EDA-Robot
